# Altium schematic sheet Supply_Voltage.SchDoc
size A4; SheetNumber: 2; SheetTotal: 8
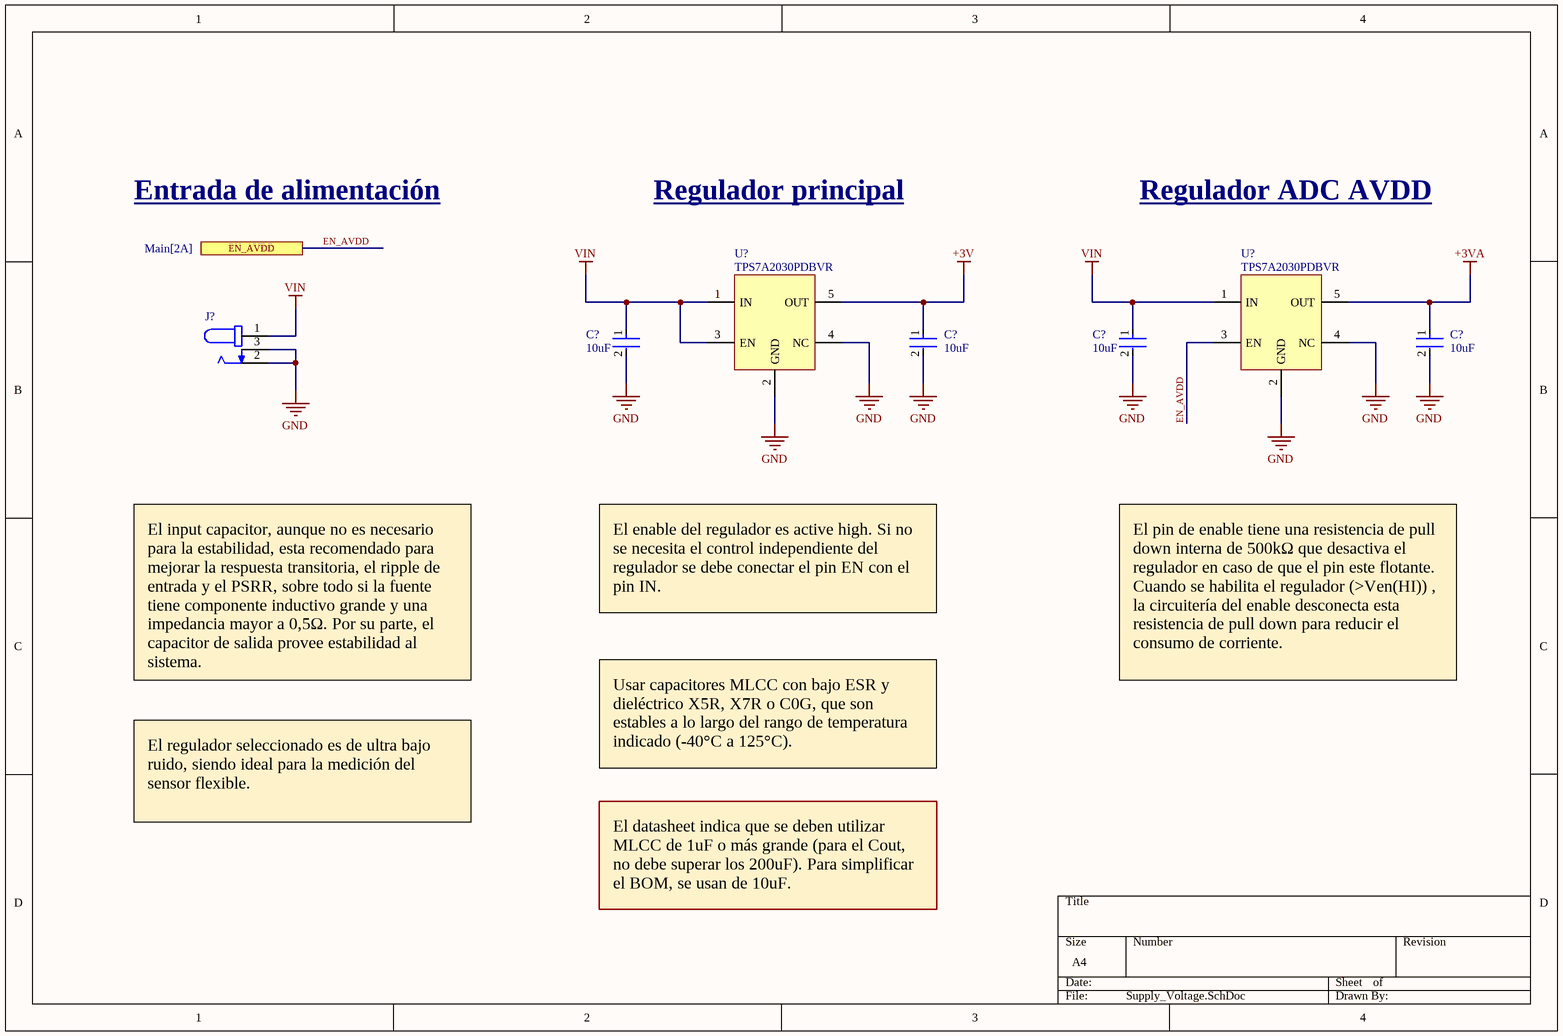
[diagram p0: Supply_Voltage.SchDoc]

## Parts
(Parts that share a designator on the sheet are numbered #1, #2 ... from top to bottom, then left to right.)
C?#1  Capacitance: 10uF  [FP-CL21-IPC_B]  (hidden comment: CL21A106KPFNNNE)
C?#2  Capacitance: 10uF  [FP-CL21-IPC_B]  (hidden comment: CL21A106KPFNNNE)
C?#3  Capacitance: 10uF  [FP-CL21-IPC_B]  (hidden comment: CL21A106KPFNNNE)
C?#4  Capacitance: 10uF  [FP-CL21-IPC_B]  (hidden comment: CL21A106KPFNNNE)
J?  DCJ200-10-A-XX-K_REVA  [GCT_DCJ200-10-A-XX-K_REVA]  (value not drawn)
U?#1  TPS7A2030PDBVR  [SOT-23 Texas]
U?#2  TPS7A2030PDBVR  [SOT-23 Texas]

## Ports
EN_AVDD (see Main[2A])

## Nets
+3V: C?#2.1 U?#1.5(OUT)
+3VA: C?#4.1 U?#2.5(OUT)
GND: C?#1.2 C?#2.2 C?#3.2 C?#4.2 J?.2 J?.3 U?#1.2(GND) U?#1.4(NC) U?#2.2(GND) U?#2.4(NC)
VIN: C?#1.1 C?#3.1 J?.1 U?#1.1(IN) U?#1.3(EN) U?#2.1(IN)
EN_AVDD: U?#2.3(EN) ; port EN_AVDD

## Notes on the sheet
- Entrada de alimentación
- Regulador principal
- Regulador ADC AVDD
- El enable del regulador es active high. Si no se necesita el control independiente del regulador se debe conectar el pin EN con el pin IN.
- El input capacitor, aunque no es necesario para la estabilidad, esta recomendado para mejorar la respuesta transitoria, el ripple de entrada y el PSRR, sobre todo si la fuente tiene componente inductivo grande y una impedancia mayor a 0,5Ω. Por su parte, el capacitor de salida provee estabilidad al sistema.
  Ambos capacitores deben ser de 1uF o mayores. En este caso se elige 10uF para simplificar el BOM.
- El pin de enable tiene una resistencia de pull down interna de 500kΩ que desactiva el regulador en caso de que el pin este flotante. Cuando se habilita el regulador (>Ven(HI)) , la circuitería del enable desconecta esta resistencia de pull down para reducir el consumo de corriente.
- Usar capacitores MLCC con bajo ESR y  dieléctrico X5R, X7R o C0G, que son estables a lo largo del rango de temperatura indicado (-40°C a 125°C).
- El regulador seleccionado es de ultra bajo ruido, siendo ideal para la medición del sensor flexible.
- El datasheet indica que se deben utilizar MLCC de 1uF o más grande (para el Cout, no debe superar los 200uF). Para simplificar el BOM, se usan de 10uF.

## Library data of the parts
C?#1-C?#4 = CMP-2000-06103-2: CL21 Series 0805 10uF 10V ±10% Tolerance X5R Multilayer Ceramic Chip Capacitor; Case Code (Imperial): 0805; Mount: Surface Mount; Depth: 1.25mm; Length: 2mm; Lead Free: Lead Free; Packaging: Tape and Reel; Dielectric: X5R; Width: 0.049inch; Package Quantity: 1; Height: 1.25mm; Case/Package: 0805; Voltage Rating: 10V; Thickness: 0.053inch; Max Operating Temperature: 85°C; Tolerance: 10%; Case Code (Metric): 2012; Contact Plating: Tin; Min Operating Temperature: -55°C; Radiation Hardening: No; Voltage Rating (DC): 10V
J? = DCJ200-10-A-XX-K_REVA: Power Barrel Connector Jack 2.05mm ID (0.081), 5.50mm OD (0.217) Through Hole, Right Angle; MF: Global Connector Technology; MP: DCJ200-10-A-K1-K; SnapEDA_Link: https://www.snapeda.com/parts/DCJ200-10-A-K1-K/Global+Connector+Technology/view-part/?ref=snap; Package: None; Value: *; Check_prices: https://www.snapeda.com/parts/DCJ200-10-A-K1-K/Global+Connector+Technology/view-part/?ref=eda
U?#1 U?#2 = TPS7A2030PDBVR: IC REG LINEAR 3.3V 300MA SOT23-5